# EAGLE design ESCapemk4 (EAGLE 7.5.0)
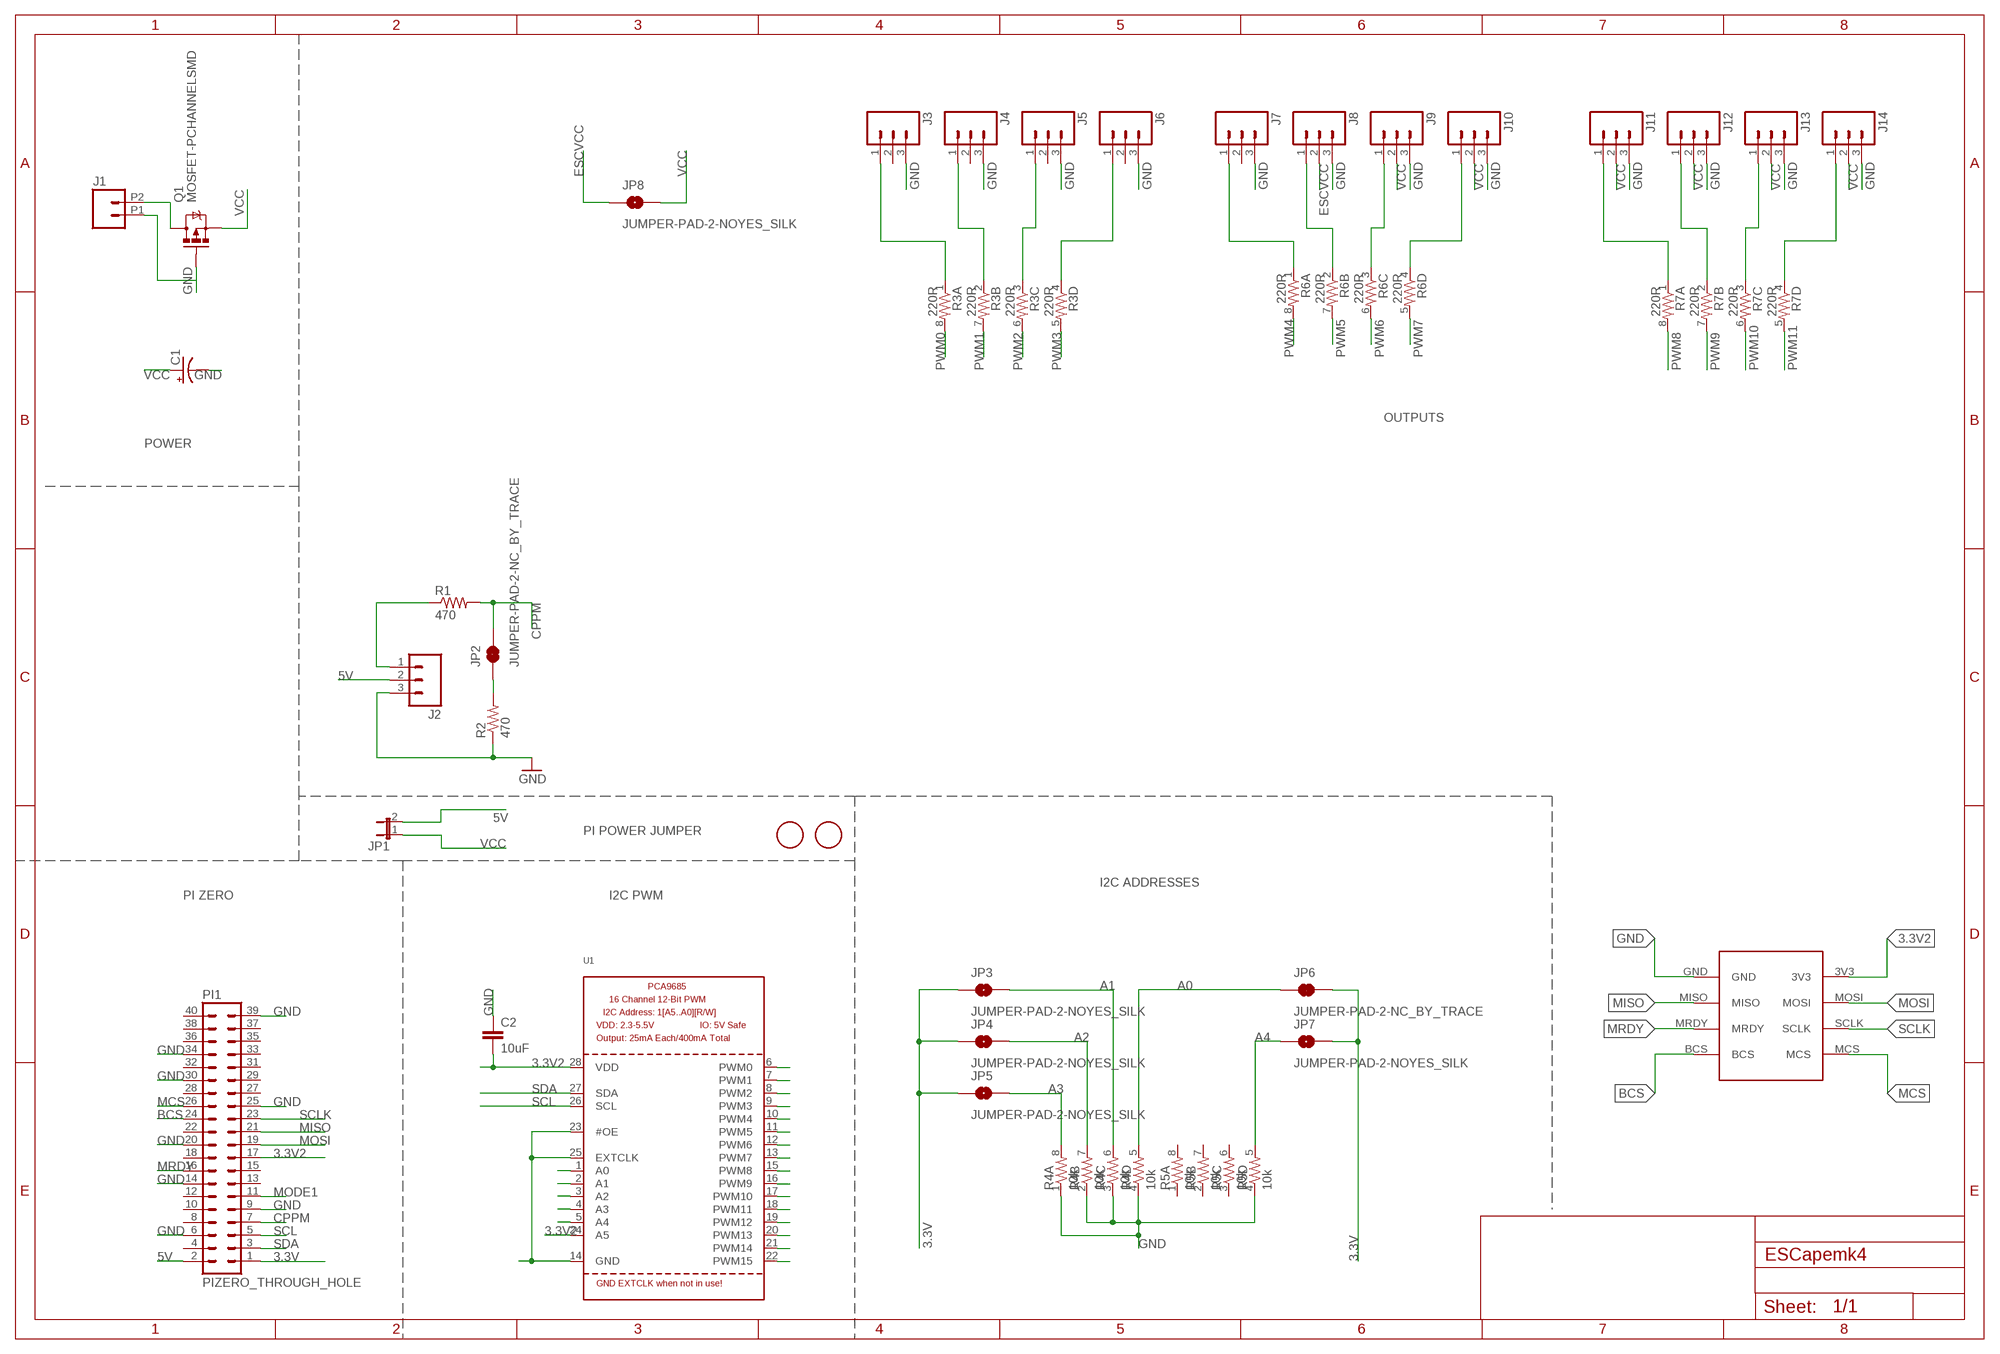
[diagram p0: schematic, sheet 1]
FRAME1 (A3L-LOC): CNAME: ESCape PCB; CREVISION: Mk2; DESIGNER: @shrkey

## Parts
C1  CAP_POLPTH1  [CPOL-RADIAL-100UF-25V]
C2  10uF  CAP0805  [0805]
FID1  FIDUCIAL  [FIDUCIAL_1MM]
FID2  FIDUCIAL  [FIDUCIAL_1MM]
J1  M022.54MM_SCREWTERM  [1X02_2.54_SCREWTERM]
J2  M03LOCK  [1X03_LOCK]
J3  M03LOCK  [1X03_LOCK]
J4  M03LOCK  [1X03_LOCK]
J5  M03LOCK  [1X03_LOCK]
J6  M03LOCK  [1X03_LOCK]
J7  M03LOCK  [1X03_LOCK]
J8  M03LOCK  [1X03_LOCK]
J9  M03LOCK  [1X03_LOCK]
J10  M03LOCK  [1X03_LOCK]
J11  M03LOCK  [1X03_LOCK]
J12  M03LOCK  [1X03_LOCK]
J13  M03LOCK  [1X03_LOCK]
J14  M03LOCK  [1X03_LOCK]
JP1  JUMPER-2PTH_LOCK  [1X02_LOCK]
JP2  JUMPER-PAD-2-NC_BY_TRACE  [PAD-JUMPER-2-NC_BY_TRACE_YES_SILK]
JP3  JUMPER-PAD-2-NOYES_SILK  [PAD-JUMPER-2-NO_YES_SILK]
JP4  JUMPER-PAD-2-NOYES_SILK  [PAD-JUMPER-2-NO_YES_SILK]
JP5  JUMPER-PAD-2-NOYES_SILK  [PAD-JUMPER-2-NO_YES_SILK]
JP6  JUMPER-PAD-2-NC_BY_TRACE  [PAD-JUMPER-2-NC_BY_TRACE_YES_SILK]
JP7  JUMPER-PAD-2-NOYES_SILK  [PAD-JUMPER-2-NO_YES_SILK]
JP8  JUMPER-PAD-2-NOYES_SILK  [PAD-JUMPER-2-NO_YES_SILK]
PI1  PIZERO_THROUGH_HOLE  [PIZERO_THOUGH_HOLE]
Q1  MOSFET-PCHANNELSMD  [SOT23-3]
R1  470  RESISTOR0805-RES  [0805]
R2  470  RESISTOR0805-RES  [0805]
R3  220R  RESISTOR-ARRAY0603-ARV  [0603-ARV]
R4  10k  RESISTOR-ARRAY0603-ARV  [0603-ARV]
R5  10k  RESISTOR-ARRAY0603-ARV  [0603-ARV]
R6  220R  RESISTOR-ARRAY0603-ARV  [0603-ARV]
R7  220R  RESISTOR-ARRAY0603-ARV  [0603-ARV]
U1  PCA9685  [TSSOP28]
U$1  2X4PADS  [2X4PADS]

## Nets
3.3V: JP3.1 JP4.1 JP5.1 JP6.2 JP7.2 PI1.1
3.3V2: C2.2 PI1.17 U1.24(A5) U1.28(VDD) U$1.3V3
5V: J2.2 JP1.2 PI1.2
A0: JP6.1 R4.5 U1.1(A0)
A1: JP3.2 R4.6 U1.2(A1)
A2: JP4.2 R4.7 U1.3(A2)
A3: JP5.2 R4.8 U1.4(A3)
A4: JP7.1 R5.5 U1.5(A4)
BCS: PI1.24 U$1.BCS
CPPM: JP2.2 PI1.7 R1.2
ESCVCC: J8.2 JP8.1
GND: C1.2(-) C2.1 J1.P1 J2.3 J3.3 J4.3 J5.3 J6.3 J7.3 J8.3 J9.3 J10.3 J11.3 J12.3 J13.3 J14.3 PI1.6 PI1.9 PI1.14 PI1.20 PI1.25 PI1.30 PI1.34 PI1.39 Q1.1(G) R2.1 R4.1 R4.2 R4.3 R4.4 R5.4 U1.14(GND) U1.23(#OE) U1.25(EXTCLK) U$1.GND
MCS: PI1.26 U$1.MCS
MISO: PI1.21 U$1.MISO
MODE1: PI1.11
MOSI: PI1.19 U$1.MOSI
MRDY: PI1.16 U$1.MRDY
N$1: J3.1 R3.1
N$2: J4.1 R3.2
N$4: J6.1 R3.4
N$5: J5.1 R3.3
N$6: J7.1 R6.1
N$7: J8.1 R6.2
N$8: J10.1 R6.4
N$9: J9.1 R6.3
N$10: J11.1 R7.1
N$11: J12.1 R7.2
N$12: J14.1 R7.4
N$13: J13.1 R7.3
N$14: J2.1 R1.1
N$16: JP2.1 R2.2
N$22: J1.P2 Q1.3(D)
PWM0: R3.8 U1.6(PWM0)
PWM1: R3.7 U1.7(PWM1)
PWM2: R3.6 U1.8(PWM2)
PWM3: R3.5 U1.9(PWM3)
PWM4: R6.8 U1.10(PWM4)
PWM5: R6.7 U1.11(PWM5)
PWM6: R6.6 U1.12(PWM6)
PWM7: R6.5 U1.13(PWM7)
PWM8: R7.8 U1.15(PWM8)
PWM9: R7.7 U1.16(PWM9)
PWM10: R7.6 U1.17(PWM10)
PWM11: R7.5 U1.18(PWM11)
PWM12: U1.19(PWM12)
PWM13: U1.20(PWM13)
PWM14: U1.21(PWM14)
PWM15: U1.22(PWM15)
SCL: PI1.5 U1.26(SCL)
SCLK: PI1.23 U$1.SCLK
SDA: PI1.3 U1.27(SDA)
VCC: C1.1(+) J9.2 J10.2 J11.2 J12.2 J13.2 J14.2 JP1.1 JP8.2 Q1.2(S)
Unconnected: J3.2 J4.2 J5.2 J6.2 J7.2 PI1.4 PI1.8 PI1.10 PI1.12 PI1.13 PI1.15 PI1.18 PI1.22 PI1.27 PI1.28 PI1.29 PI1.31 PI1.32 PI1.33 PI1.35 PI1.36 PI1.37 PI1.38 PI1.40 R5.1 R5.2 R5.3 R5.6 R5.7 R5.8

## Notes on the sheet
- OUTPUTS
- POWER
- PI POWER JUMPER
- I2C ADDRESSES
- PI ZERO | I2C PWM

## Library data of the parts
C1 = SparkFun-Passives:CAP_POL: Capacitor Polarized These are standard SMD and PTH capacitors. Normally 10uF, 47uF, and 100uF in electrolytic and tantalum varieties. Always verify the external diameter of the through hole cap, it varies with capacity, voltage, and manufacturer. The EIA devices should be standard.
C2 = SparkFun-Passives:CAP: Capacitor Standard 0603 ceramic capacitor, and 0.1" leaded capacitor.
FID1 FID2 = adafruit:FIDUCIAL: For use by pick and place machines to calibrate the vision/machine, 1mm By microbuilder.eu
J1 = SparkFun-Connectors:M02: Standard 2-pin 0.1" header. Use with - straight break away headers ( PRT-00116) - right angle break away headers (PRT-00553) - swiss pins (PRT-00743) - machine pins (PRT-00117) - female headers (PRT-00115) Molex polarized connector foot print use with: PRT-08233 with associated crimp pins and housings. 2.54_SCREWTERM for use with PRT-10571. 3.5mm Screw Terminal footprints for PRT-08084 5mm Screw Terminal footprints for use with PRT-08432
J2-J14 = SparkFun-Connectors:M03: Header 3 Standard 3-pin 0.1" header. Use with straight break away headers (SKU : PRT-00116), right angle break away headers (PRT-00553), swiss pins (PRT-00743), machine pins (PRT-00117), and female headers (PRT-00115). Molex polarized connector foot print use with SKU : PRT-08232 with associated crimp pins and housings.
JP1 = SparkFun-Retired:JUMPER-2: Jumper Basic 0.1" spaced jumper. Use with breakaway headers.
JP2 JP6 = SparkFun-Passives:JUMPER-PAD-2-NC_BY_TRACE
JP3-JP5 JP7 JP8 = SparkFun-Passives:JUMPER-PAD-2-NO
PI1 = pizero:PIZERO_THROUGH_HOLE
Q1 = SparkFun-DiscreteSemi:MOSFET-PCHANNEL: Generic PMOSFET IRLML2244 - TRANS-11153 (SOT-23 -20V -4.3A) (1.Gate 2.Source 3.Drain) FQP27P06 - COM-10349 <http://www.sparkfun.com/products/10349> (TO-220 -60V -27A) (1.Gate 2.Source 3.Drain)
R1 R2 = SparkFun-Passives:RESISTOR: Resistor Basic schematic elements and footprints for 0603, 1206, and PTH resistors.
R3-R7 = SparkFun-Resistors:RESISTOR-ARRAY: Array Chip Resistor Source: RS Component / Phycomp
U1 = adafruit:PCA9685: PCA9685 - 16 Channel 12-Bit I2C PWM Controller 5.0V tolerant 16 channel, 12-bit I2C PWM controller with 25mA per output (max. 400mA total) Digikey: 568-5931-1-ND
U$1 = expansion:2X4PADS

## Board
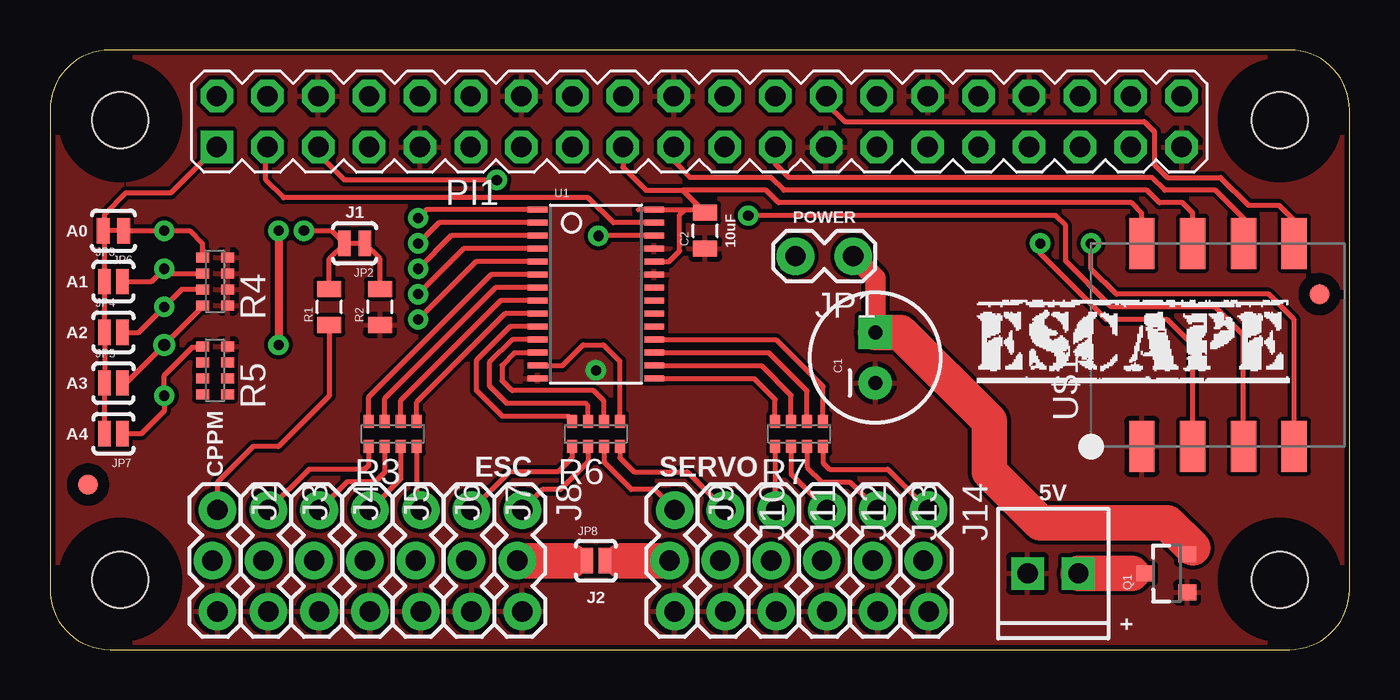
[diagram p1: board, top side]
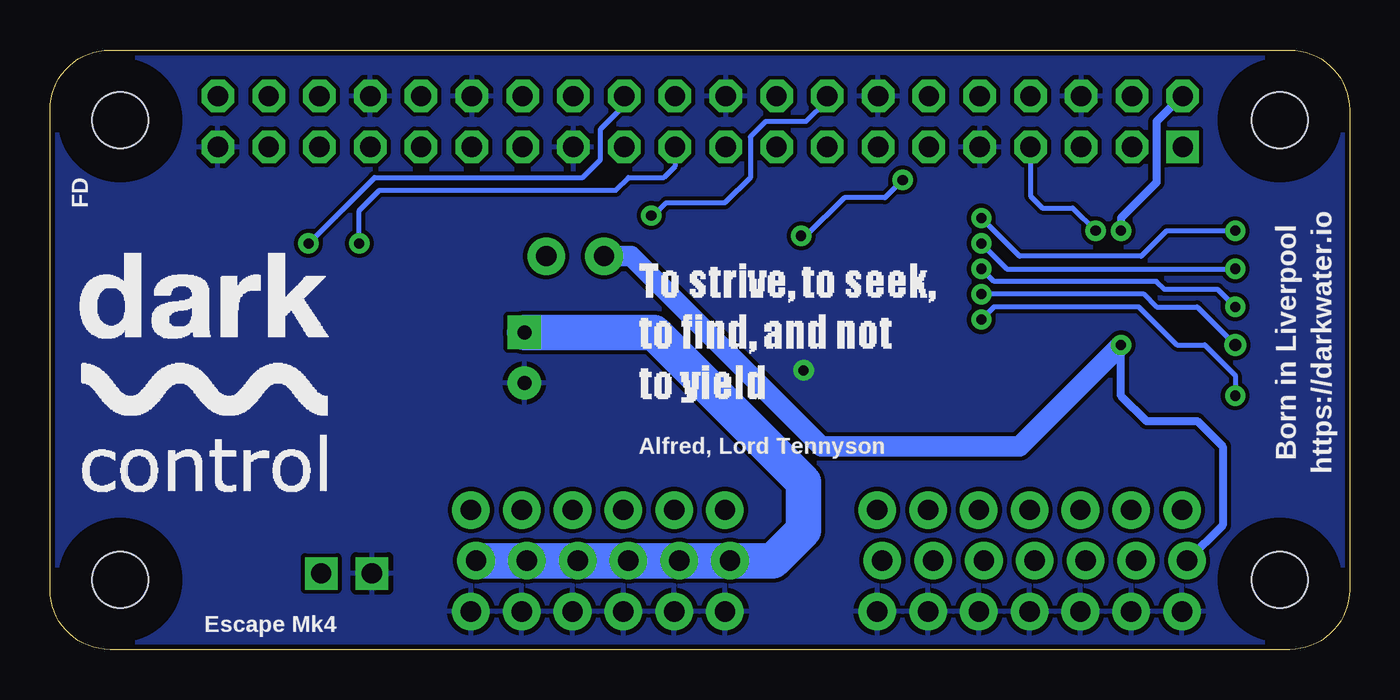
[diagram p2: board, bottom side, seen from below]

Size 65 x 30 mm. Coordinates in mm from the lower left corner, seen from the top.
Copper layers (1*16): Top 0.035mm / dielectric 1.5mm / Bottom 0.035mm
Design rules "SparkFun": minimum track width 8mil, minimum drill 20mil, track to track 8mil, track to pad 8mil, pad to pad 8mil, via to via 8mil, smd to smd 8mil, copper to edge 10mil, drill to drill 8mil, minimum pad ring 12mil, minimum via ring 10mil, stop-mask expansion 4mil, vias tented up to drill 25mil, thermal gap 10mil

### Footprints (pad centres in the part's own frame; a part is rotated, then mirrored left to right if it is on the bottom)
CPOL-RADIAL-100UF-25V = drill 0.7 pad 1.651 square: 1 1.27,0 | drill 0.7 pad 1.651: 2 -1.27,0
0805 = smd 0.8 x 1.2: 1 -0.9,0; 2 0.9,0
FIDUCIAL_1MM = smd 1 x 1: 1 0,0
1X02_2.54_SCREWTERM = drill 1.016 square: P1 2.54,0; P2 0,0
1X03_LOCK = drill 1.016 pad 1.88: 1 0,0.127; 2 2.54,-0.127; 3 5.08,0.127
1X02_LOCK = drill 1.016 pad 1.88: 1 -0.178,0; 2 2.718,0
PAD-JUMPER-2-NC_BY_TRACE_YES_SILK = smd 0.635 x 1.27: 1 -0.508,0; 2 0.508,0
PAD-JUMPER-2-NO_YES_SILK = smd 0.635 x 1.27: 1 -0.45,0; 2 0.45,0
PIZERO_THOUGH_HOLE = drill 1.016 square: 1 8.34,25.15 | drill 1.016 octagon: 2 8.34,27.69; 3 10.88,25.15; 4 10.88,27.69; 5 13.42,25.15; 6 13.42,27.69; 7 15.96,25.15; 8 15.96,27.69; 9 18.5,25.15; 10 18.5,27.69; 11 21.04,25.15; 12 21.04,27.69; 13 23.58,25.15; 14 23.58,27.69; 15 26.12,25.15; 16 26.12,27.69; 17 28.66,25.15; 18 28.66,27.69; 19 31.2,25.15; 20 31.2,27.69; 21 33.74,25.15; 22 33.74,27.69; 23 36.28,25.15; 24 36.28,27.69; 25 38.82,25.15; 26 38.82,27.69; 27 41.36,25.15; 28 41.36,27.69; 29 43.9,25.15; 30 43.9,27.69; 31 46.44,25.15; 32 46.44,27.69; 33 48.98,25.15; 34 48.98,27.69; 35 51.52,25.15; 36 51.52,27.69; 37 54.06,25.15; 38 54.06,27.69; 39 56.6,25.15; 40 56.6,27.69 | hole 2.8: 3.5,3.5; 3.5,26.5; 61.5,26.5; 61.5,3.5
SOT23-3 = smd 0.8 x 0.9: 1 -0.95,-1; 2 0.95,-1; 3 0,1.1
0603-ARV = smd 0.5 x 0.65: 1 -1.2,-0.625; 2 -0.4,-0.625; 3 0.4,-0.625; 4 1.2,-0.625; 5 1.2,0.625; 6 0.4,0.625; 7 -0.4,0.625; 8 -1.2,0.625
TSSOP28 = smd 0.305 x 0.991: 1 -4.225,-2.918; 2 -3.575,-2.918; 3 -2.925,-2.918; 4 -2.275,-2.918; 5 -1.625,-2.918; 6 -0.975,-2.918; 7 -0.325,-2.918; 8 0.325,-2.918; 9 0.975,-2.918; 10 1.625,-2.918; 11 2.275,-2.918; 12 2.925,-2.918; 13 3.575,-2.918; 14 4.225,-2.918; 15 4.225,2.918; 16 3.575,2.918; 17 2.925,2.918; 18 2.275,2.918; 19 1.625,2.918; 20 0.975,2.918; 21 0.325,2.918; 22 -0.325,2.918; 23 -0.975,2.918; 24 -1.625,2.918; 25 -2.275,2.918; 26 -2.925,2.918; 27 -3.575,2.918; 28 -4.225,2.918
2X4PADS = smd 2.54 x 1.27: 3V3 5.08,3.81; BCS -5.08,-3.81; GND -5.08,3.81; MCS 5.08,-3.81; MISO -5.08,1.27; MOSI 5.08,1.27; MRDY -5.08,-1.27; SCLK 5.08,-1.27

### Placement (x,y rotation side)
C1  41.27,14.61 90 top
C2  32.77,20.95 90 top
FID1  63.5,17.78 0 top
FID2  1.91,8.26 0 top
J1  51.44,3.81 180 top
J2  8.26,6.99 270 top
J3  10.79,6.99 270 top
J4  13.34,6.99 270 top
J5  15.88,6.99 270 top
J6  18.41,6.99 270 top
J7  20.95,6.99 270 top
J8  23.5,6.99 270 top
J9  31.11,6.99 270 top
J10  33.66,6.99 270 top
J11  36.2,6.99 270 top
J12  38.73,6.99 270 top
J13  41.27,6.99 270 top
J14  43.81,6.99 270 top
JP1  40.01,19.68 180 top
JP2  15.24,20.32 180 top
JP3  3.17,18.41 0 top
JP4  3.17,15.88 0 top
JP5  3.17,13.34 0 top
JP6  3.17,20.95 180 top
JP7  3.17,10.79 180 top
JP8  27.3,4.45 0 top
PI1  0,0 0 top
Q1  55.88,3.81 90 top
R1  13.97,17.14 90 top
R2  16.51,17.14 90 top
R3  17.14,10.79 0 top
R4  8.26,18.41 90 top
R5  8.26,13.97 90 top
R6  27.3,10.79 0 top
R7  37.47,10.79 0 top
U1  27.3,17.78 270 top
U$1  58.42,15.24 90 top
U$2  [DARKCONTROLSML]  63.5,7.62 0 bottom
U$3  [ESCAPEHORIZ]  44.7,12.19 0 top
U$4  [ULYSSES]  35.81,11.81 0 bottom

### Tracks (layer width: path | path; a pad name or v marks a point on that pad's centre or on a via)
3.3V
  Top 0.254: PI1.1 6.05,22.86 3.81,22.86 2.73,21.77 2.73,20.95 JP6.2 2.73,20.9 JP3.1 JP4.1 JP5.1 JP7.2
3.3V2
  Top 0.254: 31.75,22 U1.28 29.43,22 | 31.75,22 32.62,22 C2.2 31.63,22.99 | U1.24 30.96,19.41 31.5,19.94 31.5,21.75 31.75,22 | PI1.17 28.66,24.13 29.8,22.99 31.63,22.99 | U$1.3V3 54.61,21.84 54.1,22.35 36.45,22.35 35.81,22.99 31.63,22.99
5V  (via drill 0.51)
  Top 0.406: v11.43,20.95 v11.43,15.24
  Bottom 0.406: PI1.2 8.38,27.69 9.65,26.42 9.65,23.37 11.43,21.59 v11.43,20.95 | v11.43,15.24 11.43,12.7 10.16,11.43 7.62,11.43 6.35,10.16 6.35,6.22 J2.2
  Bottom 1.016: v11.43,15.24 16.51,10.16 26.42,10.16 35.94,19.68 JP1.2
A0  (via drill 0.51)
  Top 0.254: JP6.1 v5.71,20.95 6.99,20.95 7.62,20.32 7.62,19.62 R4.5 | U1.1 18.83,22 v18.41,21.59
  Bottom 0.254: v5.71,20.95 9.14,20.95 10.41,19.68 16.51,19.68 v18.41,21.59
A1  (via drill 0.51)
  Top 0.254: R4.6 7.61,18.8 5.97,18.8 v5.71,19.05 5.08,18.41 JP3.2 | U1.2 19.45,21.36 v18.41,20.32
  Bottom 0.254: v5.71,19.05 17.14,19.05 v18.41,20.32
A2  (via drill 0.51)
  Top 0.254: R4.7 6.58,18.02 v5.71,17.14 4.45,15.88 JP4.2 | U1.3 20.07,20.7 v18.41,19.05
  Bottom 0.254: 6.35,17.78 v5.71,17.14 6.6,18.03 9.27,18.03 9.65,18.41 17.78,18.41 v18.41,19.05
A3  (via drill 0.51, 0.6)
  Top 0.254: R4.8 7.63,17.16 v5.71,15.24 3.81,13.34 JP5.2 | U1.4 20.69,20.05 v18.41,17.78
  Bottom 0.254: 6.99,16.51 v5.71,15.24 7.62,17.14 9.65,17.14 10.29,17.78 v18.41,17.78
A4  (via drill 0.51)
  Top 0.254: 3.62,11.24 JP7.1 4.57,10.79 5.71,11.94 v5.71,12.7 5.71,13.72 7.11,15.11 7.57,15.11 R5.5 | U1.5 21.31,19.41 v18.41,16.51
  Bottom 0.254: v5.71,12.7 5.71,13.72 7.24,15.24 8.64,15.24 10.54,17.14 17.78,17.14 v18.41,16.51
BCS  (via drill 0.51)
  Top 0.254: U$1.BCS 62.23,16.51 60.96,17.78 53.34,17.78 52.07,19.05 v52.07,20.32
  Bottom 0.254: PI1.24 36.28,27.22 37.47,26.04 37.47,24.51 38.35,23.62 48.77,23.62 v52.07,20.32
CPPM  (via drill 0.51)
  Top 0.254: v12.7,20.95 14.1,20.95 JP2.2 13.97,19.56 R1.2
  Bottom 0.254: PI1.7 15.96,22.69 15.37,22.1 13.84,22.1 v12.7,20.95
ESCVCC
  Top 0.61: 26.04,4.45 JP8.1
  Top 1.778: 26.04,4.45 J8.2
GND  (via drill 0.51)
  other vias: 27.3,13.97
  pour Bottom: 0,27.3 0,2.54 arc90 2.54,0 62.23,0 arc90 64.77,2.54 64.77,27.3 arc90 62.23,29.84 2.54,29.84 arc90
  pour Top: 0,27.3 0,2.54 arc90 2.54,0 62.23,0 arc90 64.77,2.54 64.77,27.3 arc90 62.23,29.84 2.54,29.84 arc90
MCS
  Top 0.254: PI1.26 38.82,27.35 39.75,26.42 54.74,26.42 55.24,25.91 55.24,24.26 55.88,23.62 58.55,23.62 59.94,22.23 61.47,22.23 62.23,21.46 U$1.MCS
MISO  (via drill 0.51)
  Top 0.254: U$1.MISO 57.15,15.24 55.88,16.51 52.83,16.51 49.53,19.81 v49.53,20.32
  Bottom 0.254: v49.53,20.32 49.53,21.97 48.51,22.99 36.7,22.99 36.07,23.62 34.29,23.62 33.74,24.17 PI1.21
MOSI
  Top 0.254: U$1.MOSI 57.15,21.84 56.64,22.35 55.5,22.35 54.86,22.99 36.7,22.99 36.07,23.62 32,23.62 31.2,24.43 PI1.19
MRDY  (via drill 0.51)
  Top 0.254: U$1.MRDY 59.69,15.75 58.29,17.14 53.09,17.14 50.8,19.43 50.8,21.21 50.29,21.72 v34.92,21.72
  Bottom 0.254: PI1.16 26.12,27.47 27.18,26.42 29.21,26.42 29.97,25.65 29.97,23.62 31.24,22.35 34.16,22.35 34.8,21.72 v34.92,21.72
N$1
  Top 0.254: R3.1 15.95,9.21 15.75,9.02 12.95,9.02 J3.1
N$2
  Top 0.254: R3.2 16.75,8.87 16.26,8.38 14.86,8.38 J4.1
N$4
  Top 0.254: R3.4 18.34,7.18 J6.1
N$5
  Top 0.254: R3.3 17.55,8.53 J5.1
N$6
  Top 0.254: R6.1 26.11,9.6 25.4,8.89 22.99,8.89 J7.1
N$7
  Top 0.254: R6.2 26.91,9.38 25.53,8 24.64,8 J8.1
N$8
  Top 0.254: R6.4 28.5,9.6 29.21,8.89 31.88,8.89 J10.1
N$9
  Top 0.254: J9.1 30.23,8 29.08,8 27.7,9.38 R6.3
N$10
  Top 0.254: R7.1 36.27,7.04 J11.1
N$11
  Top 0.254: R7.2 37.06,8.78 J12.1
N$12
  Top 0.254: R7.4 38.66,9.34 38.99,9.02 41.91,9.02 J14.1
N$13
  Top 0.254: R7.3 37.87,9.12 38.61,8.38 40.01,8.38 J13.1
N$14
  Top 0.254: R1.1 13.97,12.7 11.43,10.16 10.16,10.16 8.38,8.38 J2.1
N$16
  Top 0.254: R2.2 16.51,19.56 JP2.1
N$22
  Top 0.61: 54.1,3.81 Q1.3
  Top 1.778: J1.P2 54.1,3.81
PWM0
  Top 0.254: U1.6 22.06,18.75 15.95,12.64 R3.8
PWM1
  Top 0.254: R3.7 16.75,12.55 22.3,18.11 U1.7
PWM2
  Top 0.254: U1.8 22.54,17.45 17.55,12.46 R3.6
PWM3
  Top 0.254: U1.9 22.77,16.8 18.34,12.38 R3.5
PWM4
  Top 0.254: U1.10 23.01,16.16 21.34,14.48 21.34,12.95 22.61,11.68 25.91,11.68 25.98,11.61 26.11,11.61 R6.8
PWM5
  Top 0.254: U1.11 23.12,15.51 21.97,14.35 21.97,13.21 22.86,12.32 26.8,12.32 26.91,12.21 R6.7
PWM6
  Top 0.254: R6.6 27.7,12.43 27.18,12.95 23.11,12.95 22.61,13.46 22.61,14.22 23.24,14.86 U1.12
PWM7
  Top 0.254: R6.5 28.5,14.42 27.69,15.24 26.67,15.24 25.64,14.21 U1.13
PWM8
  Top 0.254: U1.15 35.21,13.55 36.27,12.5 R7.8
PWM9
  Top 0.254: U1.16 35.58,14.21 37.06,12.72 R7.7
PWM10
  Top 0.254: R7.6 37.87,12.94 35.95,14.86 U1.17
PWM11
  Top 0.254: U1.18 36.31,15.51 38.66,13.15 R7.5
SCL  (via drill 0.51)
  Top 0.254: v22.35,23.5 14.73,23.5 13.42,24.81 PI1.5 | U1.26 v27.44,20.7 v27.43,20.7
  Bottom 0.254: v22.35,23.5 23.24,22.61 25.27,22.61 27.18,20.7 v27.43,20.7
SCLK
  Top 0.254: U$1.SCLK 59.69,21.59 58.29,22.99 55.75,22.99 55.12,23.62 36.96,23.62 36.28,24.3 PI1.23
SDA
  Top 0.254: PI1.3 10.79,25.07 10.79,23.5 11.68,22.61 26.92,22.61 28.18,21.36 U1.27
VCC
  Top 0.61: 57.15,5.08 57.15,5.03 Q1.2 | JP8.2 28.57,4.45
  Top 1.016: C1.1 41.27,18.59 JP1.1
  Top 1.778: C1.1 42.55,15.88 46.99,11.43 46.99,8.89 49.53,6.35 55.88,6.35 57.15,5.08 | J9.2 28.57,4.45
  Bottom 1.778: C1.1 34.8,15.88 27.3,8.38 27.3,5.97 28.83,4.45 J9.2 J10.2 J11.2 J12.2 J13.2 J14.2

### Text on the board
tPlace: J1 | A0 | 10uF | POWER | A1 | A2 | A3 | A4 | ESC | SERVO | CPPM | 5V | J2 | +
bPlace: FD | https://darkwater.io | Born in Liverpool | Alfred, Lord Tennyson | Escape Mk4